# Altium schematic sheet TIDA-00643_8305.SchDoc
size 431 x 279 mm; Date: Not shown in title block; ApprovedBy: Not shown in title block; CheckedBy: Not shown in title block; Author: Not shown in title block; CompanyName: Not shown in title block; DrawnBy: Hector Hernandez; Engineer: Not shown in title block; Organization: Not shown in title block; Address1: Not shown in title block; Address2: Not shown in title block; Address3: Not shown in title block; Address4: Not shown in title block; DocumentNumber: 3; Revision: Use project parameter SCH_Rev; SheetNumber: 3; SheetTotal: 5; PageSetup: Record=PageOptions|CenterHorizontal=True|CenterVertical=True|PrintScale=1.00|XCorrection=1.00|YCorrection=1.00|PrintKind=0|BorderSize=5000000|LeftOffset=0|BottomOffset=0|Orientation=2|PaperLength=1000|PaperWidth=1000|Scale=100|PaperSource=15|PrintQuality=600|MediaType=1|DitherType=10|PaperKind=Letter|PrintScaleMode=1; CurrentTime: Not shown in title block; CurrentDate: Not shown in title block; Time: Not shown in title block; DocumentFullPathAndName: Not shown in title block; DocumentName: Not shown in title block; ModifiedDate: Not shown in title block; ImagePath: Not shown in title block
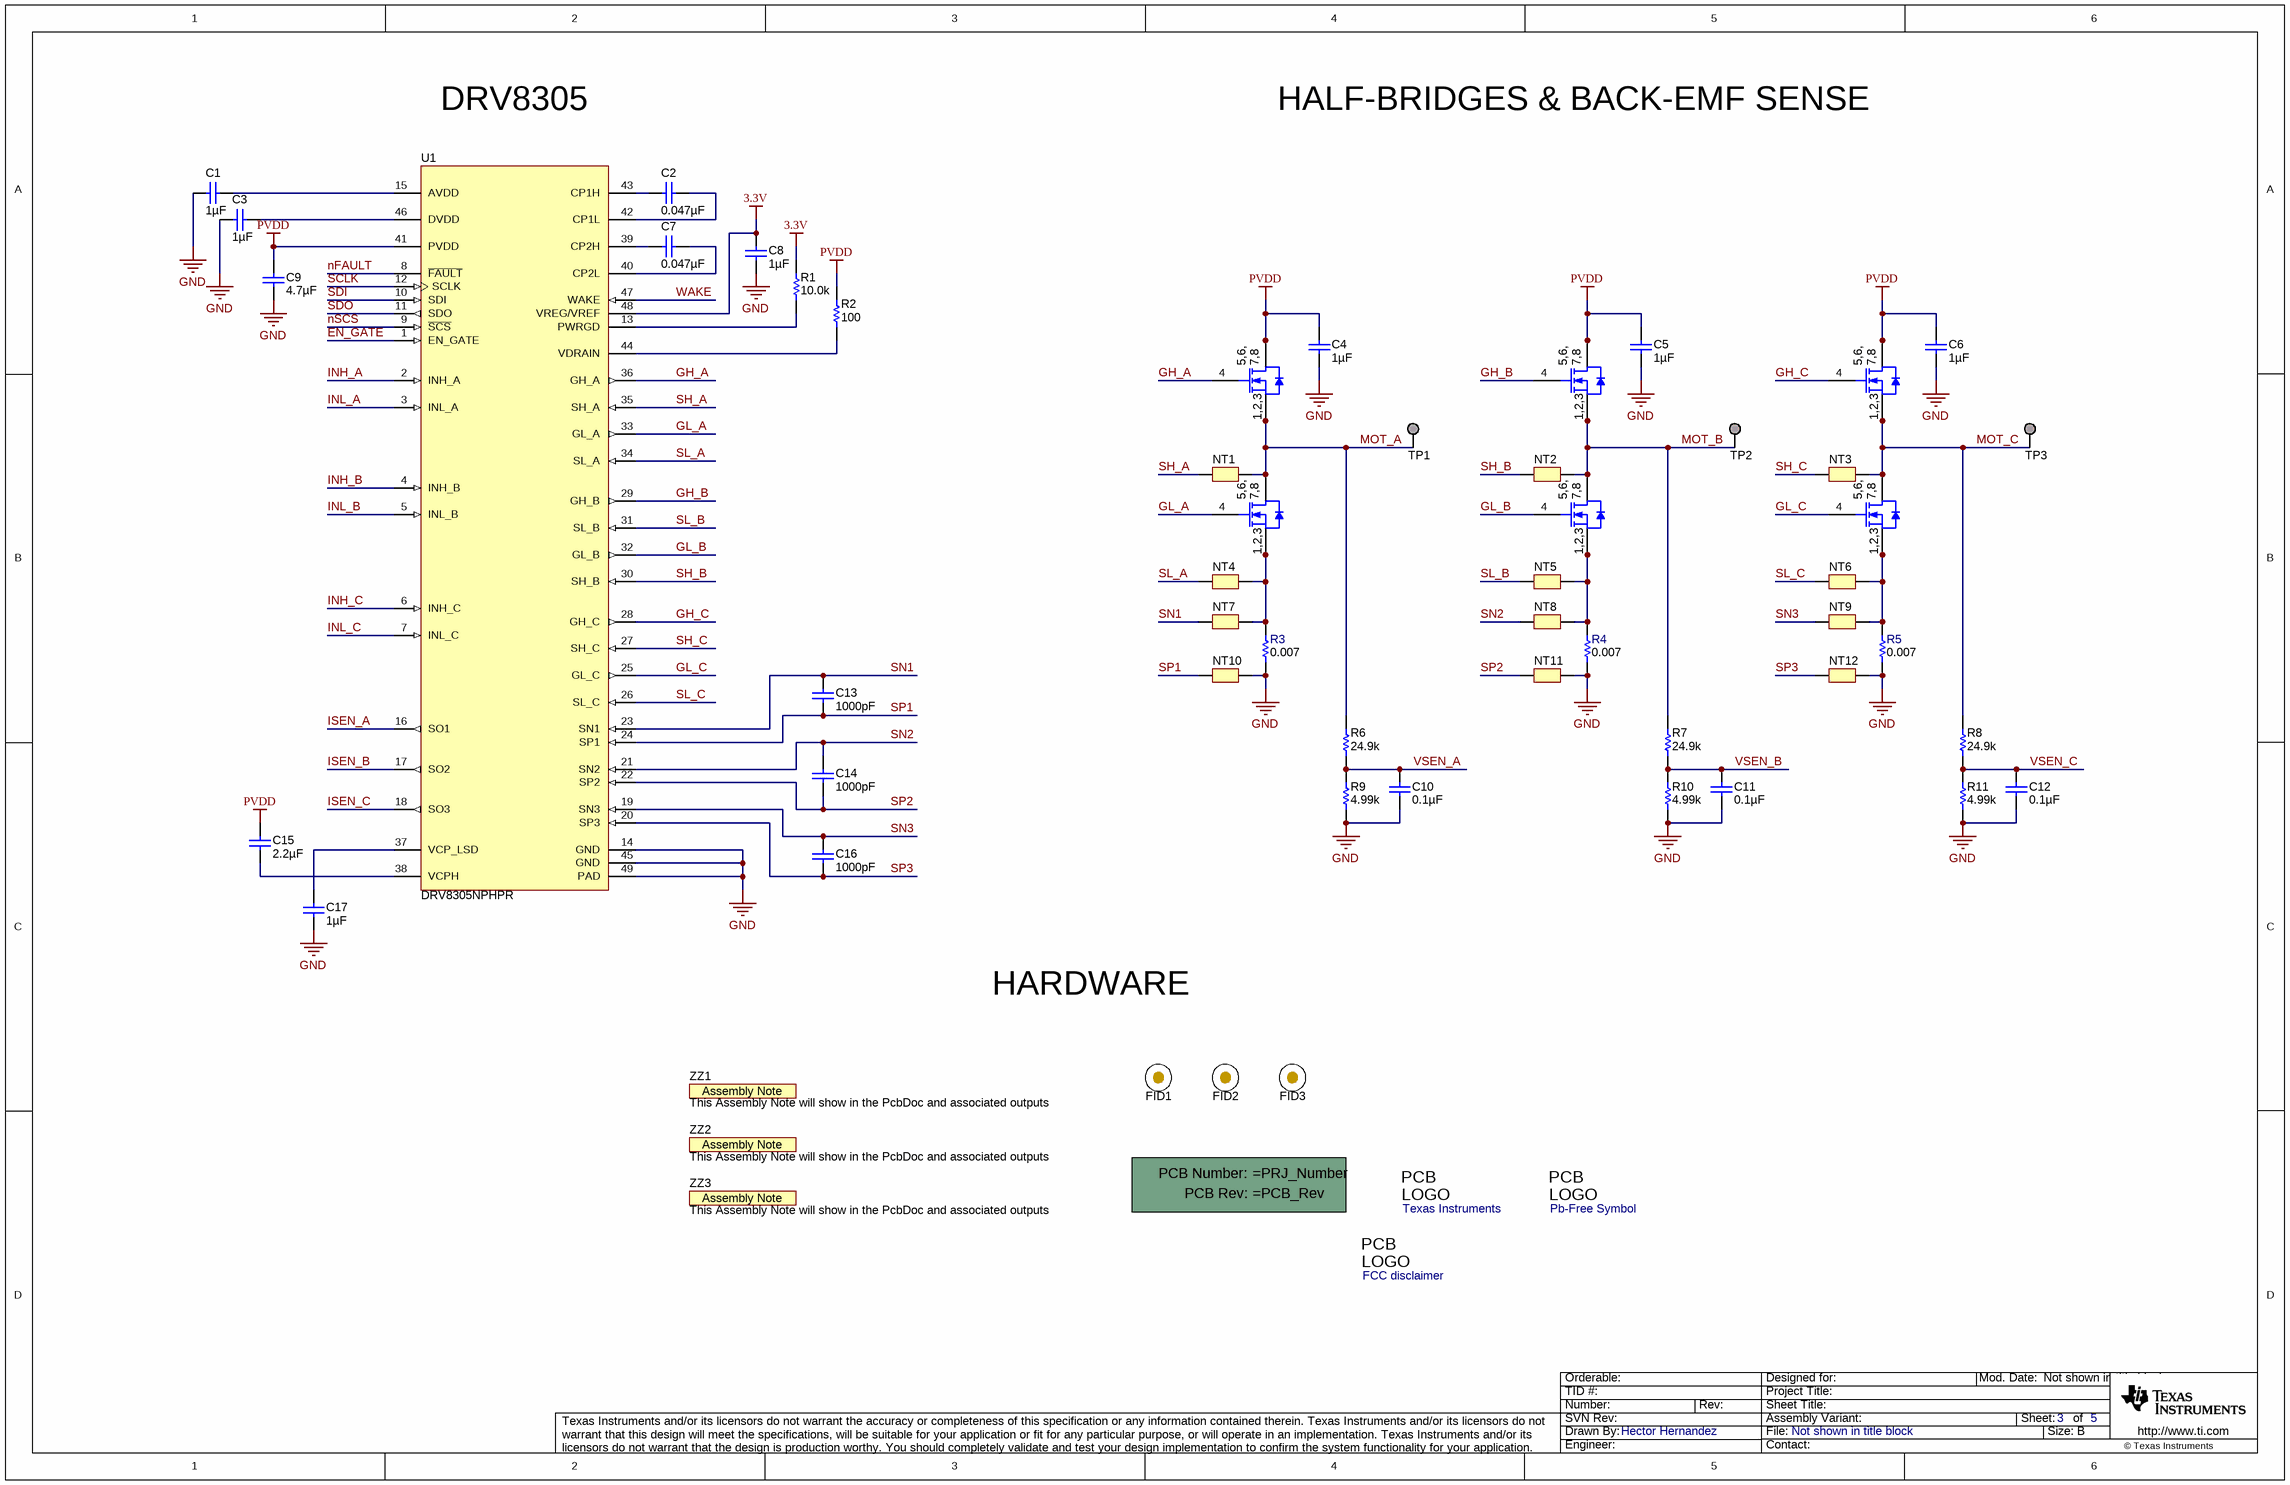
[diagram p0: TIDA-00643_8305.SchDoc]

## Parts
!PCB1  Printed Circuit Board  (value not drawn)  (mechanical)
C1  ValueDisplayed: 1µF  [0603L]  (hidden comment: GMK107BJ105KA-T)
C2  ValueDisplayed: 0.047µF  [0603L]  (hidden comment: GRM188R71E473KA01D)
C3  ValueDisplayed: 1µF  [0603L]  (hidden comment: GMK107BJ105KA-T)
C4  ValueDisplayed: 1µF  [0603L]  (hidden comment: GMK107BJ105KA-T)
C5  ValueDisplayed: 1µF  [0603L]  (hidden comment: GMK107BJ105KA-T)
C6  ValueDisplayed: 1µF  [0603L]  (hidden comment: GMK107BJ105KA-T)
C7  ValueDisplayed: 0.047µF  [0603L]  (hidden comment: GRM188R71E473KA01D)
C8  ValueDisplayed: 1µF  [0603L]  (hidden comment: GRM188R61C105KA93D)
C9  ValueDisplayed: 4.7µF  [0603_100L]  (hidden comment: GRM188R6YA475KE15D)
C10  ValueDisplayed: 0.1µF  [0402L]  (hidden comment: 885012105016)
C11  ValueDisplayed: 0.1µF  [0402L]  (hidden comment: 885012105016)
C12  ValueDisplayed: 0.1µF  [0402L]  (hidden comment: 885012105016)
C13  ValueDisplayed: 1000pF  [0402L]  (hidden comment: GRM1555C1H102JA01D)
C14  ValueDisplayed: 1000pF  [0402L]  (hidden comment: GRM1555C1H102JA01D)
C15  ValueDisplayed: 2.2µF  [0603L]  (hidden comment: GRM188R6YA225KA12D)
C16  ValueDisplayed: 1000pF  [0402L]  (hidden comment: GRM1555C1H102JA01D)
C17  ValueDisplayed: 1µF  [0603L]  (hidden comment: GMK107BJ105KA-T)
FID1  Fiducial  [Fiducial6.4-20]  (value not drawn)
FID2  Fiducial  [Fiducial6.4-20]  (value not drawn)
FID3  Fiducial  [Fiducial6.4-20]  (value not drawn)
Logo1  Texas Instruments  [TI_Symbol_Overlay_Small]  (no BOM)
Logo2  Pb-Free Symbol  [Pb-Free_Overlay_Small]  (no BOM)
Logo3  FCC disclaimer  [FCC_disclaimer_stacked]  (no BOM)
NT1  Net-Tie  [Net-Tie_10mil]  (value not drawn)  (net tie, no BOM)
NT2  Net-Tie  [Net-Tie_10mil]  (value not drawn)  (net tie, no BOM)
NT3  Net-Tie  [Net-Tie_10mil]  (value not drawn)  (net tie, no BOM)
NT4  Net-Tie  [Net-Tie_10mil]  (value not drawn)  (net tie, no BOM)
NT5  Net-Tie  [Net-Tie_10mil]  (value not drawn)  (net tie, no BOM)
NT6  Net-Tie  [Net-Tie_10mil]  (value not drawn)  (net tie, no BOM)
NT7  Net-Tie  [Net-Tie_10mil]  (value not drawn)  (net tie, no BOM)
NT8  Net-Tie  [Net-Tie_10mil]  (value not drawn)  (net tie, no BOM)
NT9  Net-Tie  [Net-Tie_10mil]  (value not drawn)  (net tie, no BOM)
NT10  Net-Tie  [Net-Tie_10mil]  (value not drawn)  (net tie, no BOM)
NT11  Net-Tie  [Net-Tie_10mil]  (value not drawn)  (net tie, no BOM)
NT12  Net-Tie  [Net-Tie_10mil]  (value not drawn)  (net tie, no BOM)
Q1  CSD17573Q5B  [TRANS_NexFET_Q5B]  (value not drawn)
Q2  CSD17573Q5B  [TRANS_NexFET_Q5B]  (value not drawn)
Q3  CSD17573Q5B  [TRANS_NexFET_Q5B]  (value not drawn)
Q4  CSD17573Q5B  [TRANS_NexFET_Q5B]  (value not drawn)
Q5  CSD17573Q5B  [TRANS_NexFET_Q5B]  (value not drawn)
Q6  CSD17573Q5B  [TRANS_NexFET_Q5B]  (value not drawn)
R1  ValueDisplayed: 10.0k  [0603L]  (hidden comment: RC0603FR-0710KL)
R2  ValueDisplayed: 100  [0603L]  (hidden comment: RC0603FR-07100RL)
R3  ValueDisplayed: 0.007  [2512L]  (hidden comment: PMR100HZPFU7L00)
R4  ValueDisplayed: 0.007  [2512L]  (hidden comment: PMR100HZPFU7L00)
R5  ValueDisplayed: 0.007  [2512L]  (hidden comment: PMR100HZPFU7L00)
R6  ValueDisplayed: 24.9k  [0603L]  (hidden comment: CRCW060324K9FKEA)
R7  ValueDisplayed: 24.9k  [0603L]  (hidden comment: CRCW060324K9FKEA)
R8  ValueDisplayed: 24.9k  [0603L]  (hidden comment: CRCW060324K9FKEA)
R9  ValueDisplayed: 4.99k  [0402L]  (hidden comment: CRCW04024K99FKED)
R10  ValueDisplayed: 4.99k  [0402L]  (hidden comment: CRCW04024K99FKED)
R11  ValueDisplayed: 4.99k  [0402L]  (hidden comment: CRCW04024K99FKED)
TP1  TESTPOINT  [TESTPOINT]  (value not drawn)  (no BOM)
TP2  TESTPOINT  [TESTPOINT]  (value not drawn)  (no BOM)
TP3  TESTPOINT  [TESTPOINT]  (value not drawn)  (no BOM)
U1  DRV8305NPHPR  [PHP0048G_L]
ZZ1  This Assembly Note will show in the PcbDoc and associated outputs  [AssemblyNote]  (no BOM)
ZZ2  This Assembly Note will show in the PcbDoc and associated outputs  [AssemblyNote]  (no BOM)
ZZ3  This Assembly Note will show in the PcbDoc and associated outputs  [AssemblyNote]  (no BOM)

## Nets
3.3V: C8.1 R1.2 U1.48(VREG/VREF)
GND: C1.1 C3.1 C4.2 C5.2 C6.2 C8.2 C9.2 C10.2 C11.2 C12.2 C17.1 NT10.2 NT11.2 NT12.2 R3.1 R4.1 R5.1 R9.1 R10.1 R11.1 U1.14(GND) U1.45(GND) U1.49(PAD)
PVDD: C4.1 C5.1 C6.1 C9.1 C15.1 Q1.5(D) Q1.6(D) Q1.7(D) Q1.8(D) Q2.5(D) Q2.6(D) Q2.7(D) Q2.8(D) Q3.5(D) Q3.6(D) Q3.7(D) Q3.8(D) R2.2 U1.41(PVDD)
EN_GATE: U1.1(EN_GATE)
GH_A: Q1.4(G) U1.36(GH_A)
GH_B: Q2.4(G) U1.29(GH_B)
GH_C: Q3.4(G) U1.28(GH_C)
GL_A: Q4.4(G) U1.33(GL_A)
GL_B: Q5.4(G) U1.32(GL_B)
GL_C: Q6.4(G) U1.25(GL_C)
INH_A: U1.2(INH_A)
INH_B: U1.4(INH_B)
INH_C: U1.6(INH_C)
INL_A: U1.3(INL_A)
INL_B: U1.5(INL_B)
INL_C: U1.7(INL_C)
ISEN_A: U1.16(SO1)
ISEN_B: U1.17(SO2)
ISEN_C: U1.18(SO3)
MOT_A: NT1.2 Q1.1(S) Q1.2(S) Q1.3(S) Q4.5(D) Q4.6(D) Q4.7(D) Q4.8(D) R6.2 TP1.1
MOT_B: NT2.2 Q2.1(S) Q2.2(S) Q2.3(S) Q5.5(D) Q5.6(D) Q5.7(D) Q5.8(D) R7.2 TP2.1
MOT_C: NT3.2 Q3.1(S) Q3.2(S) Q3.3(S) Q6.5(D) Q6.6(D) Q6.7(D) Q6.8(D) R8.2 TP3.1
nFAULT: U1.8(~{FAULT})
nSCS: U1.9(~{SCS})
SCLK: U1.12(SCLK)
SDI: U1.10(SDI)
SDO: U1.11(SDO)
SH_A: NT1.1 U1.35(SH_A)
SH_B: NT2.1 U1.30(SH_B)
SH_C: NT3.1 U1.27(SH_C)
SL_A: NT4.1 U1.34(SL_A)
SL_B: NT5.1 U1.31(SL_B)
SL_C: NT6.1 U1.26(SL_C)
SN1: C13.1 NT7.1 U1.23(SN1)
SN2: C14.1 NT8.1 U1.21(SN2)
SN3: C16.1 NT9.1 U1.19(SN3)
SP1: C13.2 NT10.1 U1.24(SP1)
SP2: C14.2 NT11.1 U1.22(SP2)
SP3: C16.2 NT12.1 U1.20(SP3)
VSEN_A: C10.1 R6.1 R9.2
VSEN_B: C11.1 R7.1 R10.2
VSEN_C: C12.1 R8.1 R11.2
WAKE: U1.47(WAKE)
NetC1_2: C1.2 U1.15(AVDD)
NetC2_1: C2.1 U1.42(CP1L)
NetC2_2: C2.2 U1.43(CP1H)
NetC3_2: C3.2 U1.46(DVDD)
NetC7_1: C7.1 U1.40(CP2L)
NetC7_2: C7.2 U1.39(CP2H)
NetC15_2: C15.2 U1.38(VCPH)
NetC17_2: C17.2 U1.37(VCP_LSD)
NetNT4_2: NT4.2 NT7.2 Q4.1(S) Q4.2(S) Q4.3(S) R3.2
NetNT5_2: NT5.2 NT8.2 Q5.1(S) Q5.2(S) Q5.3(S) R4.2
NetNT6_2: NT6.2 NT9.2 Q6.1(S) Q6.2(S) Q6.3(S) R5.2
NetR1_1: R1.1 U1.13(PWRGD)
NetR2_1: R2.1 U1.44(VDRAIN)

## Notes on the sheet
- DRV8305
- HALF-BRIDGES & BACK-EMF SENSE
- HARDWARE
- Drawn By:
- SVN Rev:
- Number:
- TID #:
- Orderable:
- Rev:
- Sheet Title:
- File:
- Project Title:
- Designed for:
- Assembly Variant:
- Mod. Date:
- Sheet:
- Size:
- of
- B
- http://www.ti.com
- Texas Instruments and/or its licensors do not warrant the accuracy or completeness of this specification or any information contained therein. Texas Instruments and/or its licensors do not warrant that this design will meet the specifications, will be suitable for your application or fit for any particular purpose, or will operate in an implementation. Texas Instruments and/or its licensors do not warrant that the design is production worthy. You should completely validate and test your design implementation to confirm the system functionality for your application.
- Engineer:
- Contact:
- © Texas Instruments
- (in symbol AssemblyNote) Assembly Note
- (in symbol CSD17573Q5B) 5,6,; 7,8; 1,2,3
- (in symbol FCC_disclaimer) PCB; LOGO
- (in symbol Pb-Free) PCB; LOGO
- (in symbol PCB) PCB Number:; PCB Rev:
- (in symbol TI_Logo) PCB; LOGO

## Library data of the parts
!PCB1 = PCB: Manufacturer: Any; SymbolCreator: a0412235; SymbolVersion: 2012-05-30; CompType: PCB; PartNumber: =PRJ_Number; RoHS: O; MountType: N/A; Publisher: Texas Instruments; LatestRevisionDate: 2015-07-14
C1 C3-C6 C17 = GMK107BJ105KA-T: CAP, CERM, 1 µF, 35 V, +/- 10%, X5R, 0603; Manufacturer: Taiyo Yuden; Polarized: N; CompType: Capacitor; Value: 1uF; U/M: EA; Cap_F: 0.000001; Tolerance_%: 10; Value1: Unknown; VDC_V: 35; Value2: 35V; TaMin_C: -55; TaMax_C: 85; Cap_Case: 0603; SymbolVersion: 2008-07-09; PartNumber: GMK107BJ105KA-T; PackageReference: 0603; RoHS: Y; MountType: SMT; Technology: Ceramic; TempCo: X5R; Published: 2008-06-19; Publisher: Texas Instruments; ComponentLink1Description: Datasheet link; ComponentLink1URL: http://www.yuden.co.jp/or/product/category/capacitor/GMK107BJ105KA-T.pdf; Supplier 1: Digi-Key; Supplier Part Number 1: 587-1437-1-ND; Supplier 2: Mouser; Supplier Part Number 2: 963-GMK107BJ105KA-T; Supplier 3: Newark; Supplier Part Number 3: 93K5526
  C1 C3 C17: LatestRevisionDate: 2015-07-15
  C4-C6: LatestRevisionDate: 2015-07-17
C2 C7 = GRM188R71E473KA01D: CAP, CERM, 0.047 µF, 25 V, +/- 10%, X7R, 0603; Manufacturer: MuRata; Polarized: N; CompType: Capacitor; Value: 0.047uF; U/M: EA; Cap_F: 0.000000047; Tolerance_%: 10; Value1: Unknown; VDC_V: 25; Value2: 25V; TaMin_C: -55; TaMax_C: 125; Cap_Case: 0603; SymbolVersion: 2008-07-09; PartNumber: GRM188R71E473KA01D; PackageReference: 0603; RoHS: Y; MountType: SMT; Technology: Ceramic; TempCo: X7R; Published: 2008-06-19; Publisher: Texas Instruments; LatestRevisionDate: 2015-07-15; ComponentLink1Description: Datasheet link; ComponentLink1URL: http://search.murata.co.jp/Ceramy/PnsearchViewAction.do?HnOFG=ON&HnNFG=ON&SEL_CNT=50&sLang=en&sKey=GRM188R71E473KA01D&x=9&y=9&search=startwith; Supplier 1: Digi-Key; Supplier Part Number 1: 490-1522-1-ND; Supplier 2: Mouser; Supplier Part Number 2: 81-GRM39X473K25D; Supplier 3: Farnell; Supplier Part Number 3: 8820007
C8 = GRM188R61C105KA93D: CAP, CERM, 1 µF, 16 V, +/- 10%, X5R, 0603; Manufacturer: MuRata; Polarized: N; CompType: Capacitor; Value: 1uF; U/M: EA; Cap_F: 0.000001; Tolerance_%: 10; Value1: Unknown; VDC_V: 16; Value2: 16V; TaMin_C: -55; TaMax_C: 85; Cap_Case: 0603; SymbolVersion: 2008-07-09; PartNumber: GRM188R61C105KA93D; PackageReference: 0603; RoHS: Y; MountType: SMT; Technology: Ceramic; TempCo: X5R; Published: 2008-06-19; Publisher: Texas Instruments; LatestRevisionDate: 2015-07-15; ComponentLink1Description: Datasheet link; ComponentLink1URL: http://search.murata.co.jp/Ceramy/PnsearchViewAction.do?HnOFG=ON&HnNFG=ON&SEL_CNT=50&sLang=en&sKey=GRM188R61C105KA93D&x=9&y=9&search=startwith; Supplier 1: Digi-Key; Supplier Part Number 1: 490-1536-1-ND; Supplier 2: Mouser; Supplier Part Number 2: 81-GRM39R105K16; Supplier 3: Farnell; Supplier Part Number 3: 1828801
C9 = GRM188R6YA475KE15D: CAP, CERM, 4.7 µF, 35 V, +/- 10%, X5R, 0603; Manufacturer: MuRata; Polarized: N; CompType: Capacitor; Value: 4.7uF; U/M: EA; Cap_F: 0.0000047; Tolerance_%: 10; Value1: Unknown; VDC_V: 35; Value2: 35V; TaMin_C: -55; TaMax_C: 85; Cap_Case: 0603; SymbolVersion: 2008-07-09; PartNumber: GRM188R6YA475KE15D; PackageReference: 0603; RoHS: Y; MountType: SMT; Technology: Ceramic; TempCo: X5R; Published: 2008-06-19; Publisher: Texas Instruments; LatestRevisionDate: 2015-07-15; ComponentLink1Description: Datasheet link; ComponentLink1URL: http://psearch.murata.com/capacitor/product/GRM188R6YA475KE15%23.pdf; Supplier 1: Digi-Key; Supplier Part Number 1: 490-7205-1-ND; Supplier 2: Mouser; Supplier Part Number 2: 81-GRM188R6YA475KE5D; Supplier 3: Farnell; Supplier Part Number 3: 2426960
C10-C12 = 885012105016: CAP, CERM, 0.1 µF, 16 V, +/- 20%, X5R, 0402; Manufacturer: Wurth Elektronik; Polarized: N; CompType: Capacitor; Value: 0.1uF; U/M: EA; Cap_F: 0.0000001; Tolerance_%: 20; Value1: Unknown; VDC_V: 16; Value2: 16V; TaMin_C: -55; TaMax_C: 85; Cap_Case: 0402; SymbolVersion: 2008-07-09; PartNumber: 885012105016; PackageReference: 0402; RoHS: Y; MountType: SMT; Technology: Ceramic; TempCo: X5R; Published: 2008-06-19; Publisher: Texas Instruments; LatestRevisionDate: 2015-07-15; ComponentLink1Description: Datasheet link; ComponentLink1URL: http://katalog.we-online.de/pbs/datasheet/885012105016.pdf; Supplier 1: Mouser; Supplier Part Number 1: 710-885012105016; Supplier 2: Newark; Supplier Part Number 2: 40Y4445
C13 C14 C16 = GRM1555C1H102JA01D: CAP, CERM, 1000 pF, 50 V, +/- 5%, C0G/NP0, 0402; Manufacturer: MuRata; Polarized: N; CompType: Capacitor; Value: 1000pF; U/M: EA; Cap_F: 0.000000001; Tolerance_%: 5; Value1: Unknown; VDC_V: 50; Value2: 50V; TaMin_C: -55; TaMax_C: 125; Cap_Case: 0402; SymbolVersion: 2008-07-09; PartNumber: GRM1555C1H102JA01D; PackageReference: 0402; RoHS: Y; MountType: SMT; Technology: Ceramic; TempCo: C0G/NP0; Published: 2008-06-19; Publisher: Texas Instruments; LatestRevisionDate: 2015-07-15; ComponentLink1Description: Datasheet link; ComponentLink1URL: http://search.murata.co.jp/Ceramy/PnsearchViewAction.do?HnOFG=ON&HnNFG=ON&SEL_CNT=50&sLang=en&sKey=GRM1555C1H102JA01D&x=9&y=9&search=startwith; Supplier 1: Digi-Key; Supplier Part Number 1: 490-3244-1-ND; Supplier 2: Mouser; Supplier Part Number 2: 81-GRM1555C1H102JA1D; Supplier 3: Farnell; Supplier Part Number 3: 8819556
C15 = GRM188R6YA225KA12D: CAP, CERM, 2.2 µF, 35 V, +/- 10%, X5R, 0603; Manufacturer: MuRata; Polarized: N; CompType: Capacitor; Value: 2.2uF; U/M: EA; Cap_F: 0.0000022; Tolerance_%: 10; Value1: Unknown; VDC_V: 35; Value2: 35V; TaMin_C: -55; TaMax_C: 85; Cap_Case: 0603; SymbolVersion: 2008-07-09; PartNumber: GRM188R6YA225KA12D; PackageReference: 0603; RoHS: Y; MountType: SMT; Technology: Ceramic; TempCo: X5R; Published: 2008-06-19; Publisher: Texas Instruments; LatestRevisionDate: 2015-07-15; ComponentLink1Description: Datasheet link; ComponentLink1URL: http://search.murata.co.jp/Ceramy/image/img/A01X/G101/ENG/GRM188R6YA225KA12-01.pdf; Supplier 1: Digi-Key; Supplier Part Number 1: 490-7204-6-ND
FID1-FID3 = Fiducial: Fiducial mark.  There is nothing to buy or mount.; SymbolCreator: codlsc; SymbolVersion: 2009-11-4; CompType: Fiducial; Publisher: Texas Instruments; LatestRevisionDate: 2015-06-01; LatestRevisionNote: Added Alternate PartNumber and Alternate Manufacturer parameters to appropriate components.; Manufacturer: N/A; MountType: N/A; PackageReference: N/A; PartNumber: N/A; ClassName: FiducialMark
Logo1 = TI_Logo: Texas Instrument Corporate Signature; SymbolCreator: a0412235; SymbolVersion: 2011-08-22; Published: 2009-03-03; Publisher: Texas Instruments; ClassName: Logo; LatestRevisionDate: 2014-11-20
Logo2 = Pb-Free: SymbolCreator: a0412235; SymbolVersion: 2011-08-22; Published: 2009-03-03; Publisher: Texas Instruments; LatestRevisionDate: 2014-11-20
Logo3 = FCC_disclaimer: SymbolCreator: codlsc; SymbolVersion: 2011-08-22; Published: 2009-03-03; Publisher: Texas Instruments; LatestRevisionDate: 2014-11-20
NT1-NT12 = Net-Tie: Single point connection between nets.; SymbolCreator: codlsc; SymbolVersion: 2009-07-01; MountType: SMT; PackageReference: N/A; Publisher: Texas Instruments; LatestRevisionDate: 2015-06-01; LatestRevisionNote: Added Alternate PartNumber and Alternate Manufacturer parameters to appropriate components.
Q1-Q6 = CSD17573Q5B: MOSFET, N-CH, 30 V, 100 A, SON 5x6mm; Manufacturer: Texas Instruments; Alternate Manufacturer: None; U/M: EA; ChType: N; Value: 30V; VdsMax_V: 30; Value1: 0.00145 ohm; Rdson45_ohm: 0.00145; Value2: 49 nC; QgTyp_nC: 49; Vgs_V: 20; IdsMax_A: 100; SymbolVersion: 2008-07-09; CompType: MOSFET; PartNumber: CSD17573Q5B; PackageReference: SON 5x6mm; RoHS: Y; MountType: SMT; Published: 2008-06-19; Publisher: Texas Instruments; LatestRevisionDate: 2015-07-16; LatestRevisionNote: Added parts.; ComponentLink1Description: Datasheet link; ComponentLink1URL: http://www.ti.com/lit/ds/symlink/csd17573q5b.pdf; Supplier 1: Digi-Key; Supplier Part Number 1: CSD17573Q5B-ND; Supplier 2: Mouser; Supplier Part Number 2: 595-CSD17573Q5B
R1 = RC0603FR-0710KL: RES, 10.0 k, 1%, 0.1 W, 0603; Manufacturer: Yageo America; CompType: Resistor; Value: 10.0k; Res_ohm: 10000; Value_Code: 10k0; Tolerance_%: 1; Power_W: 0.1; Value2: 0.1W; VDC_V: 150; TempCo: 200 ppm/C; EIA_Code: E96; U/M: EA; SymbolVersion: 2009-05-29; PartNumber: RC0603FR-0710KL; PackageReference: 0603; RoHS: Y; Value1: 1%; MountType: SMT; Technology: Thick Film; Published: 2008-06-26; Publisher: Texas Instruments; LatestRevisionDate: 2015-06-13; ComponentLink1Description: Datasheet link; ComponentLink1URL: http://www.yageo.com/pdf/Pu-RC0603_51_PbFree_L_2.pdf; Supplier 1: Digi-Key; Supplier Part Number 1: 311-10.0KHRCT-ND; Supplier 2: Mouser; Supplier Part Number 2: 603-RC0603FR-0710KL; Supplier 3: Farnell; Supplier Part Number 3: 9238603
R2 = RC0603FR-07100RL: RES, 100, 1%, 0.1 W, 0603; Manufacturer: Yageo America; CompType: Resistor; Value: 100; Value_Code: 100R; Tolerance_%: 1; Power_W: 0.1; Value2: 0.1W; VDC_V: 150; TempCo: 200 ppm/C; EIA_Code: E96; U/M: EA; SymbolVersion: 2009-05-29; PartNumber: RC0603FR-07100RL; PackageReference: 0603; RoHS: Y; Res_ohm: 100; Value1: 1%; MountType: SMT; Technology: Thick Film; Published: 2008-06-26; Publisher: Texas Instruments; LatestRevisionDate: 2015-06-13; ComponentLink1Description: Datasheet link; ComponentLink1URL: http://www.yageo.com/pdf/Pu-RC0603_51_PbFree_L_2.pdf; Supplier 1: Digi-Key; Supplier Part Number 1: 311-100HRCT-ND; Supplier 2: Mouser; Supplier Part Number 2: 603-RC0603FR-07100RL; Supplier 3: Farnell; Supplier Part Number 3: 9238360
R3-R5 = PMR100HZPFU7L00: RES, 0.007, 1%, 2 W, 2512; Manufacturer: Rohm; CompType: Resistor; Value: 0.007; Value_Code: 7L000; Tolerance_%: 1; Power_W: 2; Value2: 2W; TempCo: 100 ppm/C; EIA_Code: E96; U/M: EA; SymbolVersion: 2009-05-29; PartNumber: PMR100HZPFU7L00; PackageReference: 2512; RoHS: Y; Res_ohm: 0.007; Value1: 1%; MountType: SMT; Technology: Thick Film; Published: 2008-06-26; Publisher: Texas Instruments; LatestRevisionDate: 2015-04-21; ComponentLink1Description: Datasheet link; ComponentLink1URL: http://media.digikey.com/pdf/Data%20Sheets/Rohm%20PDFs/PMR100-SERIES.pdf; Supplier 1: Digi-Key; Supplier Part Number 1: RHM.007AUCT-ND
R6-R8 = CRCW060324K9FKEA: RES, 24.9 k, 1%, 0.1 W, 0603; Manufacturer: Vishay-Dale; CompType: Resistor; Value: 24.9k; Res_ohm: 24900; Value_Code: 24k9; Tolerance_%: 1; Power_W: 0.1; Value2: 0.1W; VDC_V: 75; TempCo: 100 ppm/C; EIA_Code: E96; U/M: EA; SymbolVersion: 2009-05-29; PartNumber: CRCW060324K9FKEA; PackageReference: 0603; RoHS: Y; Value1: 1%; MountType: SMT; Technology: Thick Film; Published: 2008-06-26; Publisher: Texas Instruments; LatestRevisionDate: 2015-06-13; ComponentLink1Description: Datasheet link; ComponentLink1URL: http://www.vishay.com/docs/20035/dcrcwe3.pdf; Supplier 1: Digi-Key; Supplier Part Number 1: 541-24.9KHCT-ND; Supplier 2: Mouser; Supplier Part Number 2: 71-CRCW0603-24.9K-E3; Supplier 3: Farnell; Supplier Part Number 3: 1469785
R9-R11 = CRCW04024K99FKED: RES, 4.99 k, 1%, 0.063 W, 0402; Manufacturer: Vishay-Dale; CompType: Resistor; Value: 4.99k; Res_ohm: 4990; Value_Code: 4k99; Tolerance_%: 1; Power_W: 0.063; Value2: 0.063W; VDC_V: 50; TempCo: 100 ppm/C; EIA_Code: E96; U/M: EA; SymbolVersion: 2009-05-29; PartNumber: CRCW04024K99FKED; PackageReference: 0402; RoHS: Y; Value1: 1%; MountType: SMT; Technology: Thick Film; Published: 2008-06-26; Publisher: Texas Instruments; LatestRevisionDate: 2015-07-01; ComponentLink1Description: Datasheet link; ComponentLink1URL: http://www.vishay.com/docs/20035/dcrcwe3.pdf; Supplier 1: Digi-Key; Supplier Part Number 1: 541-4.99KLCT-ND; Supplier 2: Mouser; Supplier Part Number 2: 71-CRCW0402-4.99K-E3; Supplier 3: Farnell; Supplier Part Number 3: 1469715
TP1-TP3 = TESTPOINT: TEST POINT.  No entry in BOM.; SymbolVersion: 2010-10-20; CompType: Testpoint; PackageReference: N/A; Publisher: Texas Instruments; LatestRevisionDate: 2015-06-01; LatestRevisionNote: Added Alternate PartNumber and Alternate Manufacturer parameters to appropriate components.
U1 = DRV83053EPHPRQ1: Three Phase Automotive Gate Driver with Three Integrated Current Shunt Amplifiers and Voltage Regulator, PHP0048G; Manufacturer: Texas Instruments; SymbolCreator: Altium; CompType: IC; U/M: EA; SymbolVersion: 2015-02-03; PartNumber: DRV8305NPHPR; Alternate PartNumber: DRV8305NPHP; PackageReference: PHP0048G; MountType: SMT; ComponentLink1Description: Datasheet Link; ComponentLink1URL: https://sps06.itg.ti.com/sites/KMS/crossdivteams/altium/docs/ComponentDatasheets/TI_Q100_3PhPredriver_DRV8305_v9.pdf; Publisher: Texas Instruments; LatestRevisionDate: 2015-07-15; Alternate Manufacturer: Texas Instruments
ZZ1-ZZ3 = AssemblyNote: SymbolCreator: codlsc; SymbolVersion: 2010-05-18; CompType: AssemblyNote; ClassName: AssemblyNote; Publisher: Texas Instruments; LatestRevisionDate: 2015-07-14